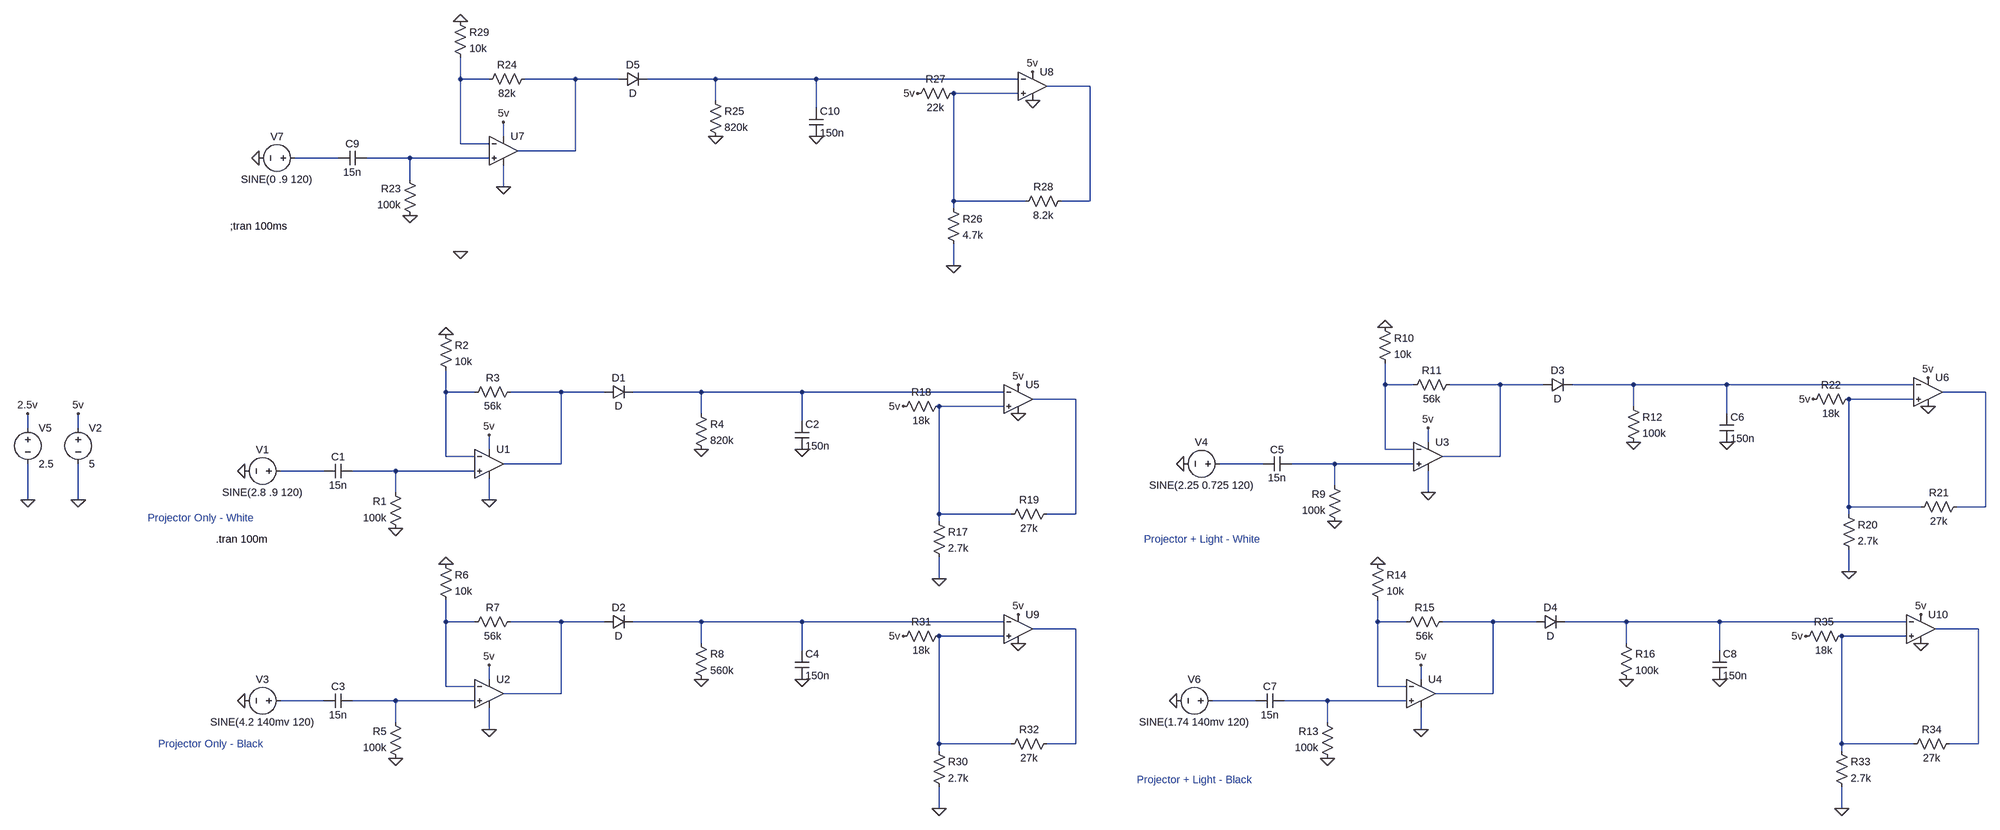
[diagram p0: schematic simulations.asc]
simulations.asc, the LTspice schematic file:
Version 4
SHEET 1 3604 964
WIRE -272 -1168 -272 -1216
WIRE -208 -1168 -272 -1168
WIRE -16 -1168 -128 -1168
WIRE 80 -1168 -16 -1168
WIRE 336 -1168 144 -1168
WIRE 560 -1168 336 -1168
WIRE 1056 -1168 560 -1168
WIRE 1216 -1152 1120 -1152
WIRE 1056 -1136 912 -1136
WIRE 336 -1120 336 -1168
WIRE 560 -1104 560 -1168
WIRE -176 -1040 -176 -1072
WIRE -272 -1024 -272 -1168
WIRE -208 -1024 -272 -1024
WIRE -16 -1008 -16 -1168
WIRE -16 -1008 -144 -1008
WIRE -544 -992 -640 -992
WIRE -384 -992 -480 -992
WIRE -208 -992 -384 -992
WIRE -384 -944 -384 -992
WIRE -176 -928 -176 -976
WIRE 912 -896 912 -1136
WIRE 1072 -896 912 -896
WIRE 1216 -896 1216 -1152
WIRE 1216 -896 1152 -896
WIRE 912 -880 912 -896
WIRE 912 -752 912 -800
WIRE 2192 0 2192 -48
WIRE 2256 0 2192 0
WIRE 2448 0 2336 0
WIRE 2544 0 2448 0
WIRE 2800 0 2608 0
WIRE 3024 0 2800 0
WIRE 3440 0 3024 0
WIRE -304 16 -304 -32
WIRE -240 16 -304 16
WIRE -48 16 -160 16
WIRE 48 16 -48 16
WIRE 304 16 112 16
WIRE 528 16 304 16
WIRE 1024 16 528 16
WIRE 3600 16 3504 16
WIRE 1184 32 1088 32
WIRE 3440 32 3296 32
WIRE 1024 48 880 48
WIRE 2800 48 2800 0
WIRE 304 64 304 16
WIRE 3024 64 3024 0
WIRE 528 80 528 16
WIRE -1456 96 -1456 64
WIRE -1344 96 -1344 64
WIRE 2288 128 2288 96
WIRE -208 144 -208 112
WIRE 2192 144 2192 0
WIRE 2256 144 2192 144
WIRE -304 160 -304 16
WIRE -240 160 -304 160
WIRE 2448 160 2448 0
WIRE 2448 160 2320 160
WIRE -48 176 -48 16
WIRE -48 176 -176 176
WIRE 1920 176 1824 176
WIRE 2080 176 1984 176
WIRE 2256 176 2080 176
WIRE -576 192 -672 192
WIRE -416 192 -512 192
WIRE -240 192 -416 192
WIRE 2080 224 2080 176
WIRE -416 240 -416 192
WIRE 2288 240 2288 192
WIRE -1456 256 -1456 176
WIRE -1344 256 -1344 176
WIRE -208 256 -208 208
WIRE 3296 272 3296 32
WIRE 3456 272 3296 272
WIRE 3600 272 3600 16
WIRE 3600 272 3536 272
WIRE 880 288 880 48
WIRE 1040 288 880 288
WIRE 1184 288 1184 32
WIRE 1184 288 1120 288
WIRE 3296 288 3296 272
WIRE 880 304 880 288
WIRE 3296 416 3296 368
WIRE 880 432 880 384
WIRE -304 528 -304 480
WIRE -240 528 -304 528
WIRE -48 528 -160 528
WIRE 48 528 -48 528
WIRE 304 528 112 528
WIRE 528 528 304 528
WIRE 1024 528 528 528
WIRE 2176 528 2176 480
WIRE 2240 528 2176 528
WIRE 2432 528 2320 528
WIRE 2528 528 2432 528
WIRE 2784 528 2592 528
WIRE 3008 528 2784 528
WIRE 3424 528 3008 528
WIRE 1184 544 1088 544
WIRE 3584 544 3488 544
WIRE 1024 560 880 560
WIRE 3424 560 3280 560
WIRE 304 576 304 528
WIRE 2784 576 2784 528
WIRE 528 592 528 528
WIRE 3008 592 3008 528
WIRE -208 656 -208 624
WIRE 2272 656 2272 624
WIRE -304 672 -304 528
WIRE -240 672 -304 672
WIRE 2176 672 2176 528
WIRE 2240 672 2176 672
WIRE -48 688 -48 528
WIRE -48 688 -176 688
WIRE 2432 688 2432 528
WIRE 2432 688 2304 688
WIRE -576 704 -672 704
WIRE -416 704 -512 704
WIRE -240 704 -416 704
WIRE 1904 704 1808 704
WIRE 2064 704 1968 704
WIRE 2240 704 2064 704
WIRE -416 752 -416 704
WIRE 2064 752 2064 704
WIRE -208 768 -208 720
WIRE 2272 768 2272 720
WIRE 880 800 880 560
WIRE 1040 800 880 800
WIRE 1184 800 1184 544
WIRE 1184 800 1120 800
WIRE 3280 800 3280 560
WIRE 3440 800 3280 800
WIRE 3584 800 3584 544
WIRE 3584 800 3520 800
WIRE 880 816 880 800
WIRE 3280 816 3280 800
WIRE 880 944 880 896
WIRE 3280 944 3280 896
FLAG -752 192 0
FLAG -416 320 0
FLAG -304 -112 0
FLAG -1344 64 5v
FLAG -208 112 5v
FLAG -1344 256 0
FLAG -208 256 0
FLAG 304 144 0
FLAG 528 144 0
FLAG 1744 176 0
FLAG 2080 304 0
FLAG 2192 -128 0
FLAG 2288 96 5v
FLAG 2288 240 0
FLAG 2800 128 0
FLAG 3024 128 0
FLAG -752 704 0
FLAG -416 832 0
FLAG -304 400 0
FLAG -208 624 5v
FLAG -208 768 0
FLAG 304 656 0
FLAG 528 656 0
FLAG 880 432 0
FLAG 800 48 5v
FLAG 1056 0 5v
FLAG 1056 64 0
FLAG -1456 64 2.5v
FLAG -1456 256 0
FLAG 3296 416 0
FLAG 3472 -16 5v
FLAG 3472 48 0
FLAG 3216 32 5v
FLAG -720 -992 0
FLAG -384 -864 0
FLAG -176 -1072 5v
FLAG -176 -928 0
FLAG 336 -1040 0
FLAG 560 -1040 0
FLAG -272 -784 0
FLAG 912 -752 0
FLAG 832 -1136 5v
FLAG 1088 -1184 5v
FLAG 1088 -1120 0
FLAG -272 -1296 0
FLAG 880 944 0
FLAG 800 560 5v
FLAG 1056 512 5v
FLAG 1056 576 0
FLAG 1728 704 0
FLAG 2064 832 0
FLAG 2176 400 0
FLAG 2272 624 5v
FLAG 2272 768 0
FLAG 2784 656 0
FLAG 3008 656 0
FLAG 3280 944 0
FLAG 3456 512 5v
FLAG 3456 576 0
FLAG 3200 560 5v
SYMBOL voltage -656 192 R90
WINDOW 0 -32 56 VBottom 2
WINDOW 3 32 56 VTop 2
WINDOW 123 60 56 VTop 2
WINDOW 39 0 0 Left 0
SYMATTR InstName V1
SYMATTR Value SINE(2.8 .9 120)
SYMBOL voltage -1344 80 R0
WINDOW 123 0 0 Left 0
WINDOW 39 0 0 Left 0
SYMATTR InstName V2
SYMATTR Value 5
SYMBOL res -400 336 R180
WINDOW 0 36 76 Left 2
WINDOW 3 36 40 Left 2
SYMATTR InstName R1
SYMATTR Value 100k
SYMBOL Opamps\\UniversalOpamp2 -208 176 R0
SYMATTR InstName U1
SYMBOL cap -512 176 R90
WINDOW 0 0 32 VBottom 2
WINDOW 3 32 32 VTop 2
SYMATTR InstName C1
SYMATTR Value 15n
SYMBOL res -320 -128 R0
SYMATTR InstName R2
SYMATTR Value 10k
SYMBOL res -144 0 R90
WINDOW 0 0 56 VBottom 2
WINDOW 3 32 56 VTop 2
SYMATTR InstName R3
SYMATTR Value 56k
SYMBOL res 288 48 R0
SYMATTR InstName R4
SYMATTR Value 820k
SYMBOL cap 512 80 R0
SYMATTR InstName C2
SYMATTR Value 150n
SYMBOL diode 48 32 R270
WINDOW 0 32 32 VTop 2
WINDOW 3 0 32 VBottom 2
SYMATTR InstName D1
SYMBOL voltage 1840 176 R90
WINDOW 0 -32 56 VBottom 2
WINDOW 3 32 56 VTop 2
WINDOW 123 60 56 VTop 2
WINDOW 39 0 0 Left 0
SYMATTR InstName V4
SYMATTR Value SINE(2.25 0.725 120)
SYMBOL res 2096 320 R180
WINDOW 0 36 76 Left 2
WINDOW 3 36 40 Left 2
SYMATTR InstName R9
SYMATTR Value 100k
SYMBOL Opamps\\UniversalOpamp2 2288 160 R0
SYMATTR InstName U3
SYMBOL cap 1984 160 R90
WINDOW 0 0 32 VBottom 2
WINDOW 3 32 32 VTop 2
SYMATTR InstName C5
SYMATTR Value 15n
SYMBOL res 2176 -144 R0
SYMATTR InstName R10
SYMATTR Value 10k
SYMBOL res 2352 -16 R90
WINDOW 0 0 56 VBottom 2
WINDOW 3 32 56 VTop 2
SYMATTR InstName R11
SYMATTR Value 56k
SYMBOL res 2784 32 R0
SYMATTR InstName R12
SYMATTR Value 100k
SYMBOL cap 3008 64 R0
SYMATTR InstName C6
SYMATTR Value 150n
SYMBOL diode 2544 16 R270
WINDOW 0 32 32 VTop 2
WINDOW 3 0 32 VBottom 2
SYMATTR InstName D3
SYMBOL voltage -656 704 R90
WINDOW 0 -32 56 VBottom 2
WINDOW 3 32 56 VTop 2
WINDOW 123 60 56 VTop 2
WINDOW 39 0 0 Left 0
SYMATTR InstName V3
SYMATTR Value SINE(4.2 140mv 120)
SYMBOL res -400 848 R180
WINDOW 0 36 76 Left 2
WINDOW 3 36 40 Left 2
SYMATTR InstName R5
SYMATTR Value 100k
SYMBOL Opamps\\UniversalOpamp2 -208 688 R0
SYMATTR InstName U2
SYMBOL cap -512 688 R90
WINDOW 0 0 32 VBottom 2
WINDOW 3 32 32 VTop 2
SYMATTR InstName C3
SYMATTR Value 15n
SYMBOL res -320 384 R0
SYMATTR InstName R6
SYMATTR Value 10k
SYMBOL res -144 512 R90
WINDOW 0 0 56 VBottom 2
WINDOW 3 32 56 VTop 2
SYMATTR InstName R7
SYMATTR Value 56k
SYMBOL res 288 560 R0
SYMATTR InstName R8
SYMATTR Value 560k
SYMBOL cap 512 592 R0
SYMATTR InstName C4
SYMATTR Value 150n
SYMBOL diode 48 544 R270
WINDOW 0 32 32 VTop 2
WINDOW 3 0 32 VBottom 2
SYMATTR InstName D2
SYMBOL Opamps\\UniversalOpamp2 1056 32 R0
SYMATTR InstName U5
SYMBOL res 864 288 R0
SYMATTR InstName R17
SYMATTR Value 2.7k
SYMBOL res 896 32 R90
WINDOW 0 0 56 VBottom 2
WINDOW 3 32 56 VTop 2
SYMATTR InstName R18
SYMATTR Value 18k
SYMBOL res 1136 272 R90
WINDOW 0 0 56 VBottom 2
WINDOW 3 32 56 VTop 2
SYMATTR InstName R19
SYMATTR Value 27k
SYMBOL voltage -1456 80 R0
WINDOW 123 0 0 Left 0
WINDOW 39 0 0 Left 0
SYMATTR InstName V5
SYMATTR Value 2.5
SYMBOL Opamps\\UniversalOpamp2 3472 16 R0
SYMATTR InstName U6
SYMBOL res 3280 272 R0
SYMATTR InstName R20
SYMATTR Value 2.7k
SYMBOL res 3552 256 R90
WINDOW 0 0 56 VBottom 2
WINDOW 3 32 56 VTop 2
SYMATTR InstName R21
SYMATTR Value 27k
SYMBOL res 3312 16 R90
WINDOW 0 0 56 VBottom 2
WINDOW 3 32 56 VTop 2
SYMATTR InstName R22
SYMATTR Value 18k
SYMBOL voltage -624 -992 R90
WINDOW 0 -32 56 VBottom 2
WINDOW 3 32 56 VTop 2
WINDOW 123 60 56 VTop 2
WINDOW 39 0 0 Left 0
SYMATTR InstName V7
SYMATTR Value SINE(0 .9 120)
SYMBOL res -368 -848 R180
WINDOW 0 36 76 Left 2
WINDOW 3 36 40 Left 2
SYMATTR InstName R23
SYMATTR Value 100k
SYMBOL Opamps\\UniversalOpamp2 -176 -1008 R0
SYMATTR InstName U7
SYMBOL cap -480 -1008 R90
WINDOW 0 0 32 VBottom 2
WINDOW 3 32 32 VTop 2
SYMATTR InstName C9
SYMATTR Value 15n
SYMBOL res -112 -1184 R90
WINDOW 0 0 56 VBottom 2
WINDOW 3 32 56 VTop 2
SYMATTR InstName R24
SYMATTR Value 82k
SYMBOL res 320 -1136 R0
SYMATTR InstName R25
SYMATTR Value 820k
SYMBOL cap 544 -1104 R0
SYMATTR InstName C10
SYMATTR Value 150n
SYMBOL diode 80 -1152 R270
WINDOW 0 32 32 VTop 2
WINDOW 3 0 32 VBottom 2
SYMATTR InstName D5
SYMBOL Opamps\\UniversalOpamp2 1088 -1152 R0
SYMATTR InstName U8
SYMBOL res 896 -896 R0
SYMATTR InstName R26
SYMATTR Value 4.7k
SYMBOL res 928 -1152 R90
WINDOW 0 0 56 VBottom 2
WINDOW 3 32 56 VTop 2
SYMATTR InstName R27
SYMATTR Value 22k
SYMBOL res 1168 -912 R90
WINDOW 0 0 56 VBottom 2
WINDOW 3 32 56 VTop 2
SYMATTR InstName R28
SYMATTR Value 8.2k
SYMBOL res -288 -1312 R0
SYMATTR InstName R29
SYMATTR Value 10k
SYMBOL Opamps\\UniversalOpamp2 1056 544 R0
SYMATTR InstName U9
SYMBOL res 864 800 R0
SYMATTR InstName R30
SYMATTR Value 2.7k
SYMBOL res 896 544 R90
WINDOW 0 0 56 VBottom 2
WINDOW 3 32 56 VTop 2
SYMATTR InstName R31
SYMATTR Value 18k
SYMBOL res 1136 784 R90
WINDOW 0 0 56 VBottom 2
WINDOW 3 32 56 VTop 2
SYMATTR InstName R32
SYMATTR Value 27k
SYMBOL voltage 1824 704 R90
WINDOW 0 -32 56 VBottom 2
WINDOW 3 32 56 VTop 2
WINDOW 123 60 56 VTop 2
WINDOW 39 0 0 Left 0
SYMATTR InstName V6
SYMATTR Value SINE(1.74 140mv 120)
SYMBOL res 2080 848 R180
WINDOW 0 36 76 Left 2
WINDOW 3 36 40 Left 2
SYMATTR InstName R13
SYMATTR Value 100k
SYMBOL Opamps\\UniversalOpamp2 2272 688 R0
SYMATTR InstName U4
SYMBOL cap 1968 688 R90
WINDOW 0 0 32 VBottom 2
WINDOW 3 32 32 VTop 2
SYMATTR InstName C7
SYMATTR Value 15n
SYMBOL res 2160 384 R0
SYMATTR InstName R14
SYMATTR Value 10k
SYMBOL res 2336 512 R90
WINDOW 0 0 56 VBottom 2
WINDOW 3 32 56 VTop 2
SYMATTR InstName R15
SYMATTR Value 56k
SYMBOL res 2768 560 R0
SYMATTR InstName R16
SYMATTR Value 100k
SYMBOL cap 2992 592 R0
SYMATTR InstName C8
SYMATTR Value 150n
SYMBOL diode 2528 544 R270
WINDOW 0 32 32 VTop 2
WINDOW 3 0 32 VBottom 2
SYMATTR InstName D4
SYMBOL Opamps\\UniversalOpamp2 3456 544 R0
SYMATTR InstName U10
SYMBOL res 3264 800 R0
SYMATTR InstName R33
SYMATTR Value 2.7k
SYMBOL res 3536 784 R90
WINDOW 0 0 56 VBottom 2
WINDOW 3 32 56 VTop 2
SYMATTR InstName R34
SYMATTR Value 27k
SYMBOL res 3296 544 R90
WINDOW 0 0 56 VBottom 2
WINDOW 3 32 56 VTop 2
SYMATTR InstName R35
SYMATTR Value 18k
TEXT -816 344 Left 2 !.tran 100m
TEXT -784 -840 Left 2 !;tran 100ms
TEXT -968 296 Left 2 ;Projector Only - White
TEXT -944 800 Left 2 ;Projector Only - Black
TEXT 1656 344 Left 2 ;Projector + Light - White
TEXT 1640 880 Left 2 ;Projector + Light - Black

The netlist it stands for:
* simulations.asc
V1 N020 0 SINE(2.8 .9 120)
V2 5v 0 5
R1 0 N021 100k
XU1 N021 N011 5v 0 N012 level.2 Avol=1Meg GBW=10Meg Slew=10Meg ilimit=25m rail=0 Vos=0 phimargin=45 en=0 enk=0 in=0 ink=0 Rin=500Meg  ; pins IN+ IN- V+ V- OUT
C1 N021 N020 15n
R2 0 N011 10k
R3 N012 N011 56k
R4 N013 0 820k
C2 N013 0 150n
D1 N012 N013 D
V4 N018 0 SINE(2.25 0.725 120)
R9 0 N019 100k
XU3 N019 N008 5v 0 N009 level.2 Avol=1Meg GBW=10Meg Slew=10Meg ilimit=25m rail=0 Vos=0 phimargin=45 en=0 enk=0 in=0 ink=0 Rin=500Meg  ; pins IN+ IN- V+ V- OUT
C5 N019 N018 15n
R10 0 N008 10k
R11 N009 N008 56k
R12 N010 0 100k
C6 N010 0 150n
D3 N009 N010 D
V3 N032 0 SINE(4.2 140mv 120)
R5 0 N033 100k
XU2 N033 N022 5v 0 N023 level.2 Avol=1Meg GBW=10Meg Slew=10Meg ilimit=25m rail=0 Vos=0 phimargin=45 en=0 enk=0 in=0 ink=0 Rin=500Meg  ; pins IN+ IN- V+ V- OUT
C3 N033 N032 15n
R6 0 N022 10k
R7 N023 N022 56k
R8 N024 0 560k
C4 N024 0 150n
D2 N023 N024 D
XU5 N017 N013 5v 0 N015 level.2 Avol=1Meg GBW=10Meg Slew=10Meg ilimit=25m rail=0 Vos=0 phimargin=45 en=0 enk=0 in=0 ink=0 Rin=500Meg  ; pins IN+ IN- V+ V- OUT
R17 N017 0 2.7k
R18 N017 5v 18k
R19 N015 N017 27k
V5 2.5v 0 2.5
XU6 N016 N010 5v 0 N014 level.2 Avol=1Meg GBW=10Meg Slew=10Meg ilimit=25m rail=0 Vos=0 phimargin=45 en=0 enk=0 in=0 ink=0 Rin=500Meg  ; pins IN+ IN- V+ V- OUT
R20 N016 0 2.7k
R21 N014 N016 27k
R22 N016 5v 18k
V7 N006 0 SINE(0 .9 120)
R23 0 N007 100k
XU7 N007 N001 5v 0 N002 level.2 Avol=1Meg GBW=10Meg Slew=10Meg ilimit=25m rail=0 Vos=0 phimargin=45 en=0 enk=0 in=0 ink=0 Rin=500Meg  ; pins IN+ IN- V+ V- OUT
C9 N007 N006 15n
R24 N002 N001 82k
R25 N003 0 820k
C10 N003 0 150n
D5 N002 N003 D
XU8 N005 N003 5v 0 N004 level.2 Avol=1Meg GBW=10Meg Slew=10Meg ilimit=25m rail=0 Vos=0 phimargin=45 en=0 enk=0 in=0 ink=0 Rin=500Meg  ; pins IN+ IN- V+ V- OUT
R26 N005 0 4.7k
R27 N005 5v 22k
R28 N004 N005 8.2k
R29 0 N001 10k
XU9 N030 N024 5v 0 N028 level.2 Avol=1Meg GBW=10Meg Slew=10Meg ilimit=25m rail=0 Vos=0 phimargin=45 en=0 enk=0 in=0 ink=0 Rin=500Meg  ; pins IN+ IN- V+ V- OUT
R30 N030 0 2.7k
R31 N030 5v 18k
R32 N028 N030 27k
V6 N034 0 SINE(1.74 140mv 120)
R13 0 N035 100k
XU4 N035 N025 5v 0 N026 level.2 Avol=1Meg GBW=10Meg Slew=10Meg ilimit=25m rail=0 Vos=0 phimargin=45 en=0 enk=0 in=0 ink=0 Rin=500Meg  ; pins IN+ IN- V+ V- OUT
C7 N035 N034 15n
R14 0 N025 10k
R15 N026 N025 56k
R16 N027 0 100k
C8 N027 0 150n
D4 N026 N027 D
XU10 N031 N027 5v 0 N029 level.2 Avol=1Meg GBW=10Meg Slew=10Meg ilimit=25m rail=0 Vos=0 phimargin=45 en=0 enk=0 in=0 ink=0 Rin=500Meg  ; pins IN+ IN- V+ V- OUT
R33 N031 0 2.7k
R34 N029 N031 27k
R35 N031 5v 18k
.model D D
.lib standard.dio
.tran 100m
;tran 100ms
* Projector Only - White
* Projector Only - Black
* Projector + Light - White
* Projector + Light - Black
.lib UniversalOpamps2.sub
.backanno
.end